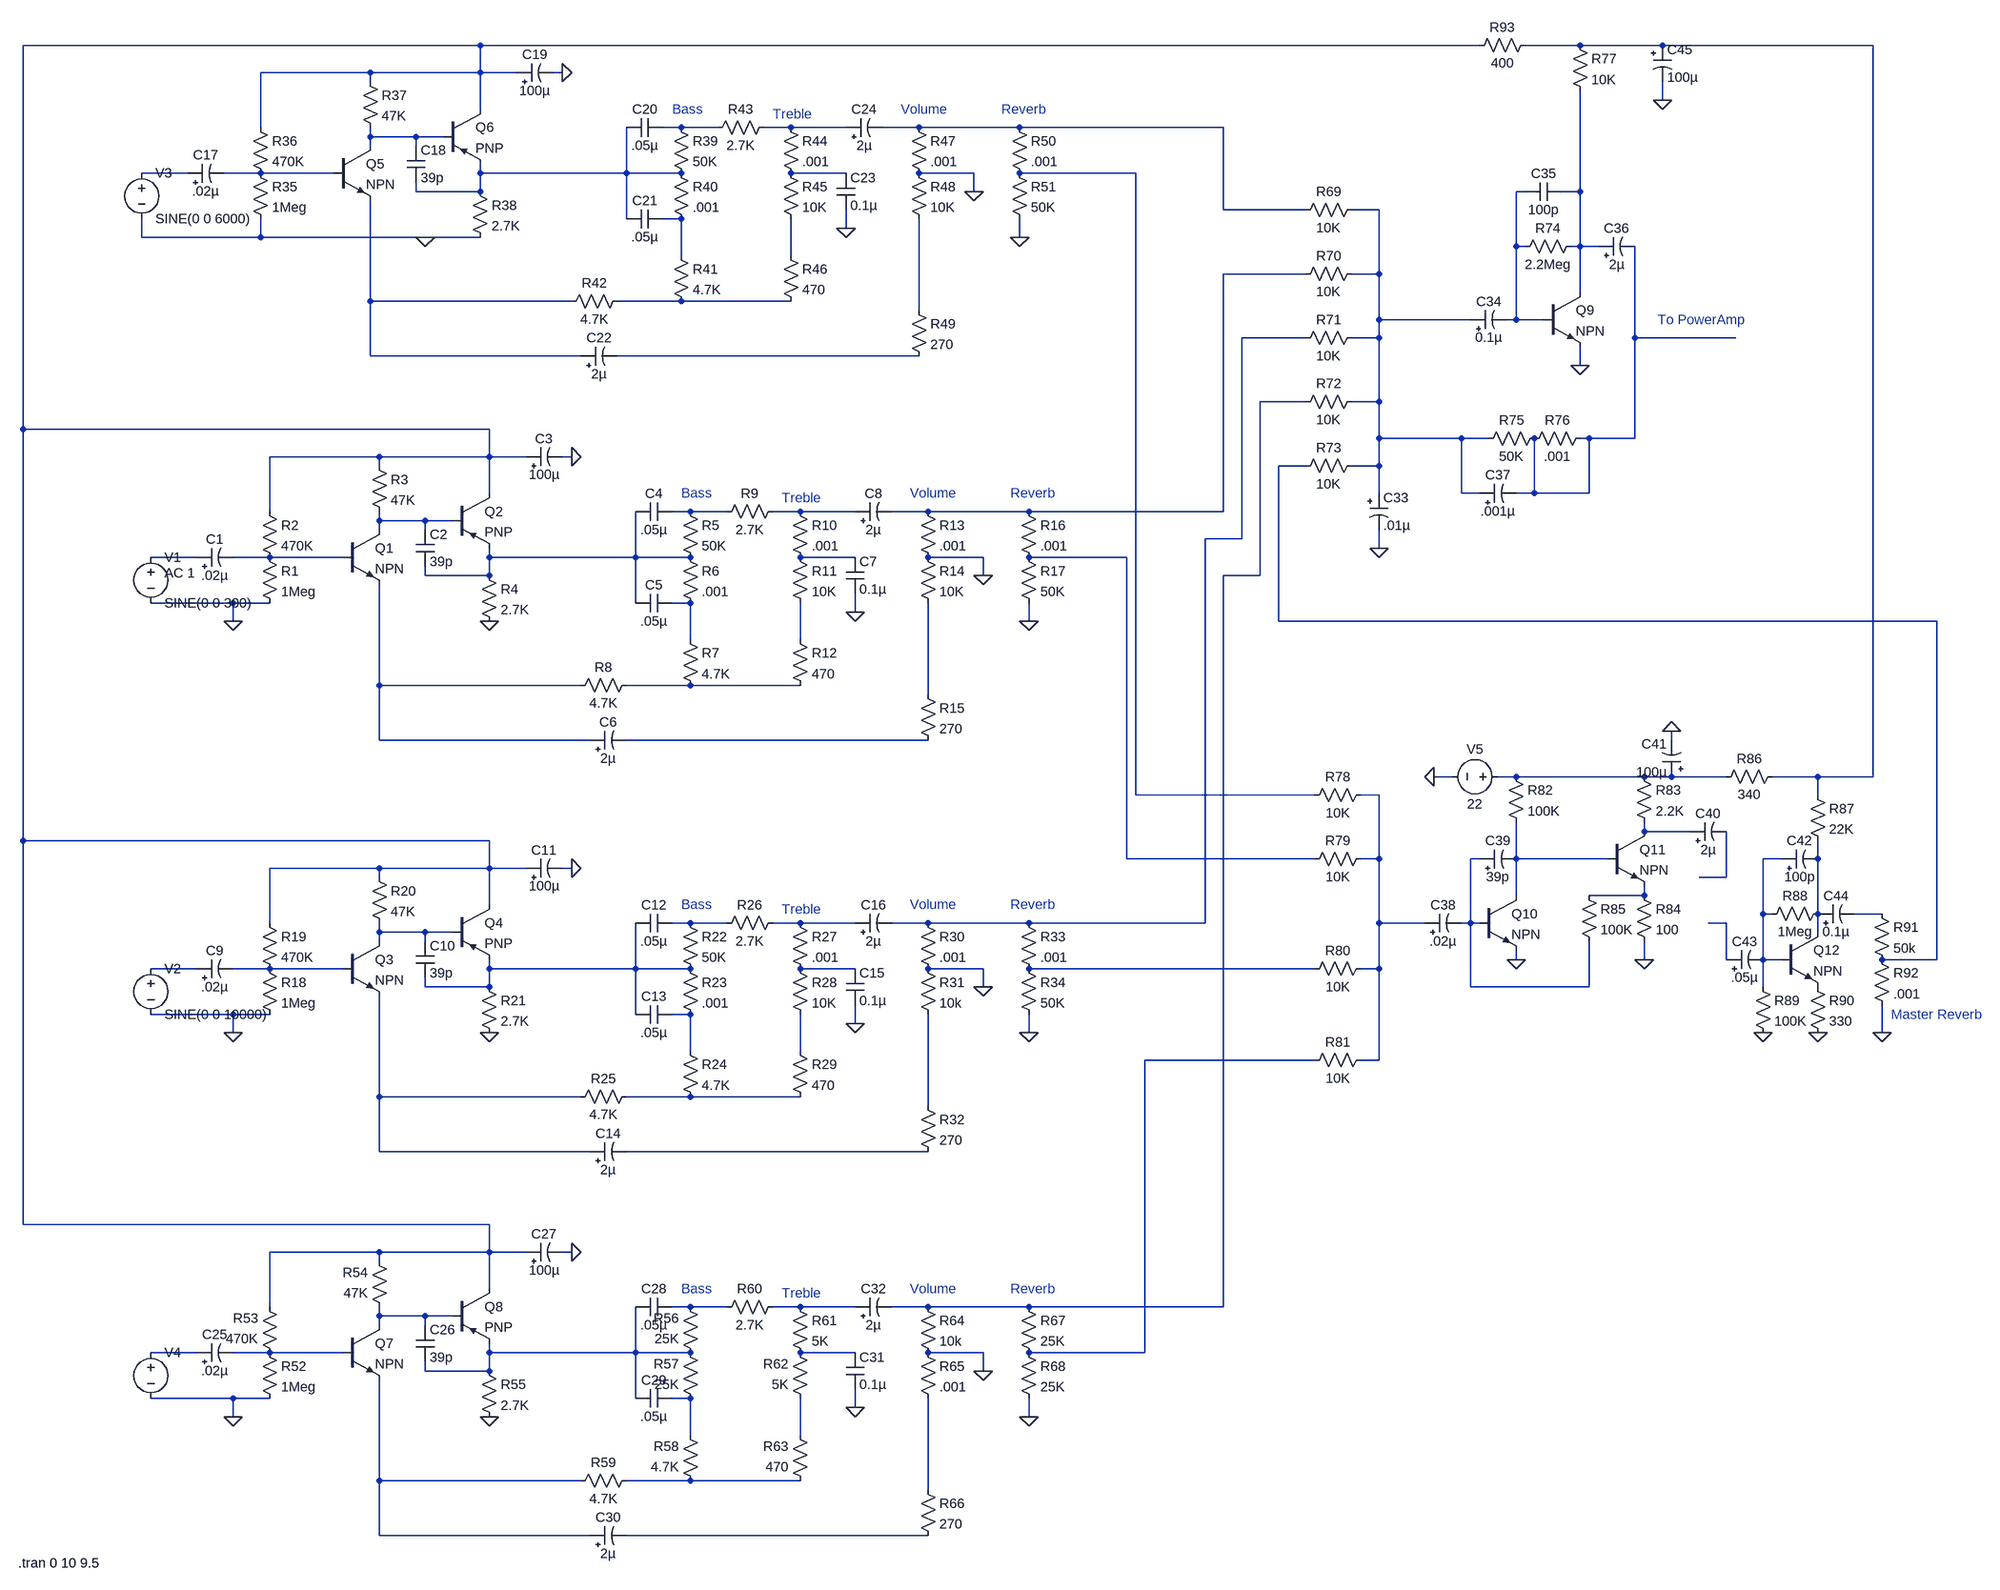
[diagram p0: schematic PA120.asc]
PA120.asc, the LTspice schematic file:
Version 4
SHEET 1 3108 1588
WIRE -64 -1088 -864 -1088
WIRE 2208 -1088 -64 -1088
WIRE 2384 -1088 2288 -1088
WIRE 2528 -1088 2384 -1088
WIRE 2896 -1088 2528 -1088
WIRE -256 -1040 -448 -1040
WIRE -64 -1040 -64 -1088
WIRE -64 -1040 -256 -1040
WIRE 0 -1040 -64 -1040
WIRE 80 -1040 64 -1040
WIRE -256 -1024 -256 -1040
WIRE 2528 -992 2528 -1024
WIRE -64 -976 -64 -1040
WIRE -448 -944 -448 -1040
WIRE 288 -944 256 -944
WIRE 352 -944 288 -944
WIRE 480 -944 432 -944
WIRE 576 -944 480 -944
WIRE 704 -944 640 -944
WIRE 880 -944 704 -944
WIRE 1760 -944 880 -944
WIRE -256 -928 -256 -944
WIRE -176 -928 -256 -928
WIRE -128 -928 -176 -928
WIRE -256 -912 -256 -928
WIRE -176 -912 -176 -928
WIRE -576 -864 -656 -864
WIRE -448 -864 -512 -864
WIRE -320 -864 -448 -864
WIRE -64 -864 -64 -880
WIRE 192 -864 192 -944
WIRE 192 -864 -64 -864
WIRE 288 -864 192 -864
WIRE 576 -864 480 -864
WIRE 800 -864 704 -864
WIRE 1168 -864 880 -864
WIRE -176 -832 -176 -848
WIRE -64 -832 -64 -864
WIRE -64 -832 -176 -832
WIRE 800 -832 800 -864
WIRE 2288 -832 2272 -832
WIRE 2384 -832 2384 -1008
WIRE 2384 -832 2352 -832
WIRE 1760 -800 1760 -944
WIRE 1904 -800 1760 -800
WIRE 2032 -800 1984 -800
WIRE 192 -784 192 -864
WIRE 288 -784 256 -784
WIRE 576 -768 576 -800
WIRE -656 -752 -656 -784
WIRE -448 -752 -448 -784
WIRE -448 -752 -656 -752
WIRE -160 -752 -448 -752
WIRE -64 -752 -160 -752
WIRE 880 -752 880 -784
WIRE 2272 -736 2272 -832
WIRE 2288 -736 2272 -736
WIRE 2384 -736 2384 -832
WIRE 2384 -736 2368 -736
WIRE 2416 -736 2384 -736
WIRE 288 -720 288 -784
WIRE 480 -720 480 -784
WIRE 1904 -688 1760 -688
WIRE 2032 -688 2032 -800
WIRE 2032 -688 1984 -688
WIRE 2384 -656 2384 -736
WIRE -256 -640 -256 -816
WIRE 96 -640 -256 -640
WIRE 288 -640 176 -640
WIRE 480 -640 288 -640
WIRE 704 -624 704 -784
WIRE 2032 -608 2032 -688
WIRE 2192 -608 2032 -608
WIRE 2272 -608 2272 -736
WIRE 2272 -608 2256 -608
WIRE 2320 -608 2272 -608
WIRE 1904 -576 1792 -576
WIRE 2032 -576 2032 -608
WIRE 2032 -576 1984 -576
WIRE 2480 -576 2480 -736
WIRE 2656 -576 2480 -576
WIRE -256 -544 -256 -640
WIRE 112 -544 -256 -544
WIRE 704 -544 176 -544
WIRE 2384 -528 2384 -560
WIRE 1904 -464 1824 -464
WIRE 2032 -464 2032 -576
WIRE 2032 -464 1984 -464
WIRE -864 -416 -864 -1088
WIRE -48 -416 -864 -416
WIRE 2032 -400 2032 -464
WIRE 2176 -400 2032 -400
WIRE 2224 -400 2176 -400
WIRE 2400 -400 2384 -400
WIRE 2480 -400 2480 -576
WIRE 2480 -400 2400 -400
WIRE -240 -368 -432 -368
WIRE -48 -368 -48 -416
WIRE -48 -368 -240 -368
WIRE 16 -368 -48 -368
WIRE 96 -368 80 -368
WIRE -240 -352 -240 -368
WIRE 1904 -352 1856 -352
WIRE 2032 -352 2032 -400
WIRE 2032 -352 1984 -352
WIRE -48 -304 -48 -368
WIRE 2032 -304 2032 -352
WIRE 2176 -304 2176 -400
WIRE 2208 -304 2176 -304
WIRE 2304 -304 2304 -400
WIRE 2304 -304 2272 -304
WIRE 2400 -304 2400 -400
WIRE 2400 -304 2304 -304
WIRE -432 -272 -432 -368
WIRE 304 -272 272 -272
WIRE 368 -272 304 -272
WIRE 496 -272 448 -272
WIRE 592 -272 496 -272
WIRE 720 -272 656 -272
WIRE 896 -272 720 -272
WIRE 1760 -272 1760 -688
WIRE 1760 -272 896 -272
WIRE -240 -256 -240 -272
WIRE -160 -256 -240 -256
WIRE -112 -256 -160 -256
WIRE -240 -240 -240 -256
WIRE -160 -240 -160 -256
WIRE 1792 -224 1792 -576
WIRE 1792 -224 1728 -224
WIRE 2032 -208 2032 -240
WIRE -560 -192 -640 -192
WIRE -432 -192 -496 -192
WIRE -304 -192 -432 -192
WIRE -48 -192 -48 -208
WIRE 208 -192 208 -272
WIRE 208 -192 -48 -192
WIRE 304 -192 208 -192
WIRE 592 -192 496 -192
WIRE 816 -192 720 -192
WIRE 1152 -192 896 -192
WIRE -160 -160 -160 -176
WIRE -48 -160 -48 -192
WIRE -48 -160 -160 -160
WIRE 816 -160 816 -192
WIRE 1824 -160 1824 -464
WIRE 1824 -160 1760 -160
WIRE -496 -112 -640 -112
WIRE -432 -112 -496 -112
WIRE 208 -112 208 -192
WIRE 304 -112 272 -112
WIRE 592 -96 592 -128
WIRE -496 -80 -496 -112
WIRE 896 -80 896 -112
WIRE 1856 -80 1856 -352
WIRE 3008 -80 1856 -80
WIRE 304 -48 304 -112
WIRE 496 -48 496 -112
WIRE -240 32 -240 -144
WIRE 112 32 -240 32
WIRE 304 32 192 32
WIRE 496 32 304 32
WIRE 720 48 720 -112
WIRE -240 128 -240 32
WIRE 128 128 -240 128
WIRE 720 128 192 128
WIRE 2544 128 2544 112
WIRE 2160 192 2128 192
WIRE 2272 192 2240 192
WIRE 2496 192 2272 192
WIRE 2544 192 2496 192
WIRE 2640 192 2544 192
WIRE 2800 192 2720 192
WIRE 2896 192 2896 -1088
WIRE 2896 192 2800 192
WIRE 1168 224 1168 -864
WIRE 1920 224 1168 224
WIRE 2032 224 2000 224
WIRE 2800 224 2800 192
WIRE 2496 288 2496 272
WIRE 2576 288 2496 288
WIRE -864 304 -864 -416
WIRE -48 304 -864 304
WIRE 1152 336 1152 -192
WIRE 1920 336 1152 336
WIRE 2032 336 2032 224
WIRE 2032 336 2000 336
WIRE 2208 336 2192 336
WIRE 2272 336 2272 272
WIRE 2432 336 2272 336
WIRE 2736 336 2704 336
WIRE 2800 336 2800 304
WIRE -240 352 -432 352
WIRE -48 352 -48 304
WIRE -48 352 -240 352
WIRE 16 352 -48 352
WIRE 96 352 80 352
WIRE -240 368 -240 352
WIRE 2640 368 2640 288
WIRE 2640 368 2592 368
WIRE 2272 400 2272 336
WIRE 2496 400 2496 384
WIRE 2496 400 2400 400
WIRE -48 416 -48 352
WIRE 2704 432 2704 336
WIRE 2720 432 2704 432
WIRE 2800 432 2800 336
WIRE 2912 432 2864 432
WIRE -432 448 -432 352
WIRE 304 448 272 448
WIRE 368 448 304 448
WIRE 496 448 448 448
WIRE 592 448 496 448
WIRE 720 448 656 448
WIRE 896 448 720 448
WIRE 1728 448 1728 -224
WIRE 1728 448 896 448
WIRE 2032 448 2032 336
WIRE 2112 448 2032 448
WIRE 2192 448 2192 336
WIRE 2192 448 2176 448
WIRE 2208 448 2192 448
WIRE 2640 448 2608 448
WIRE -240 464 -240 448
WIRE -160 464 -240 464
WIRE -112 464 -160 464
WIRE 2800 464 2800 432
WIRE -240 480 -240 464
WIRE -160 480 -160 464
WIRE 2272 512 2272 496
WIRE 2496 512 2496 480
WIRE 2640 512 2640 448
WIRE 2704 512 2704 432
WIRE 2736 512 2704 512
WIRE 3008 512 3008 -80
WIRE 3008 512 2912 512
WIRE -560 528 -640 528
WIRE -432 528 -496 528
WIRE -304 528 -432 528
WIRE -48 528 -48 512
WIRE 208 528 208 448
WIRE 208 528 -48 528
WIRE 304 528 208 528
WIRE 592 528 496 528
WIRE 816 528 720 528
WIRE 1920 528 896 528
WIRE 2032 528 2032 448
WIRE 2032 528 2000 528
WIRE -160 560 -160 544
WIRE -48 560 -48 528
WIRE -48 560 -160 560
WIRE 816 560 816 528
WIRE 2192 560 2192 448
WIRE 2400 560 2400 480
WIRE 2400 560 2192 560
WIRE 2704 560 2704 512
WIRE -496 608 -640 608
WIRE -432 608 -496 608
WIRE 208 608 208 528
WIRE 304 608 272 608
WIRE 592 624 592 592
WIRE -496 640 -496 608
WIRE 896 640 896 608
WIRE 2912 640 2912 592
WIRE 304 672 304 608
WIRE 496 672 496 608
WIRE 1920 688 1184 688
WIRE 2032 688 2032 528
WIRE 2032 688 2000 688
WIRE -240 752 -240 576
WIRE 112 752 -240 752
WIRE 304 752 192 752
WIRE 496 752 304 752
WIRE 720 768 720 608
WIRE -240 848 -240 752
WIRE 128 848 -240 848
WIRE 720 848 192 848
WIRE -864 976 -864 304
WIRE -48 976 -864 976
WIRE -240 1024 -432 1024
WIRE -48 1024 -48 976
WIRE -48 1024 -240 1024
WIRE 16 1024 -48 1024
WIRE 96 1024 80 1024
WIRE -240 1040 -240 1024
WIRE -48 1088 -48 1024
WIRE -432 1120 -432 1024
WIRE 304 1120 272 1120
WIRE 368 1120 304 1120
WIRE 496 1120 448 1120
WIRE 592 1120 496 1120
WIRE 720 1120 656 1120
WIRE 896 1120 720 1120
WIRE 1760 1120 1760 -160
WIRE 1760 1120 896 1120
WIRE -240 1136 -240 1120
WIRE -160 1136 -240 1136
WIRE -112 1136 -160 1136
WIRE -240 1152 -240 1136
WIRE -160 1152 -160 1136
WIRE -560 1200 -640 1200
WIRE -432 1200 -496 1200
WIRE -304 1200 -432 1200
WIRE -48 1200 -48 1184
WIRE 208 1200 208 1120
WIRE 208 1200 -48 1200
WIRE 304 1200 208 1200
WIRE 592 1200 496 1200
WIRE 816 1200 720 1200
WIRE 1184 1200 1184 688
WIRE 1184 1200 896 1200
WIRE -160 1232 -160 1216
WIRE -48 1232 -48 1200
WIRE -48 1232 -160 1232
WIRE 816 1232 816 1200
WIRE -496 1280 -640 1280
WIRE -432 1280 -496 1280
WIRE 208 1280 208 1200
WIRE 304 1280 272 1280
WIRE 592 1296 592 1264
WIRE -496 1312 -496 1280
WIRE 896 1312 896 1280
WIRE 304 1344 304 1280
WIRE 496 1344 496 1280
WIRE -240 1424 -240 1248
WIRE 112 1424 -240 1424
WIRE 304 1424 192 1424
WIRE 496 1424 304 1424
WIRE 720 1440 720 1280
WIRE -240 1520 -240 1424
WIRE 128 1520 -240 1520
WIRE 720 1520 192 1520
FLAG -496 -80 0
FLAG 96 -368 0
FLAG -48 -80 0
FLAG 592 -96 0
FLAG 816 -160 0
FLAG 896 -80 0
FLAG -496 640 0
FLAG 96 352 0
FLAG -48 640 0
FLAG 592 624 0
FLAG 816 560 0
FLAG 896 640 0
FLAG 80 -1040 0
FLAG 576 -768 0
FLAG 800 -832 0
FLAG 880 -752 0
FLAG -496 1312 0
FLAG 96 1024 0
FLAG -48 1312 0
FLAG 592 1296 0
FLAG 816 1232 0
FLAG 896 1312 0
FLAG 2032 -208 0
FLAG 2384 -528 0
FLAG 2272 512 0
FLAG 2496 512 0
FLAG 2544 112 0
FLAG 2704 640 0
FLAG 2800 640 0
FLAG 2912 640 0
FLAG 2128 192 0
FLAG 2528 -992 0
FLAG -160 -752 0
SYMBOL voltage -640 -208 R0
WINDOW 123 24 44 Left 0
WINDOW 39 0 0 Left 0
SYMATTR Value2 AC 1
SYMATTR InstName V1
SYMATTR Value SINE(0 0 300)
SYMBOL polcap -560 -176 R270
WINDOW 0 32 32 VTop 0
WINDOW 3 0 32 VBottom 0
SYMATTR InstName C1
SYMATTR Value .02µ
SYMATTR SpiceLine V=12
SYMBOL res -448 -208 R0
SYMATTR InstName R1
SYMATTR Value 1Meg
SYMBOL res -448 -288 R0
SYMATTR InstName R2
SYMATTR Value 470K
SYMBOL npn3 -304 -240 R0
SYMATTR InstName Q1
SYMBOL res -256 -368 R0
SYMATTR InstName R3
SYMATTR Value 47K
SYMBOL pnp2 -112 -304 R0
SYMATTR InstName Q2
SYMBOL cap -176 -240 R0
SYMATTR InstName C2
SYMATTR Value 39p
SYMBOL polcap 16 -352 R270
WINDOW 0 32 32 VTop 0
WINDOW 3 0 32 VBottom 0
SYMATTR InstName C3
SYMATTR Value 100µ
SYMBOL res -64 -176 R0
SYMATTR InstName R4
SYMATTR Value 2.7K
SYMBOL cap 272 -288 R90
WINDOW 0 0 32 VBottom 0
WINDOW 3 32 32 VTop 0
SYMATTR InstName C4
SYMATTR Value .05µ
SYMBOL cap 272 -128 R90
WINDOW 0 0 32 VBottom 0
WINDOW 3 32 32 VTop 0
SYMATTR InstName C5
SYMATTR Value .05µ
SYMBOL res 288 -288 R0
SYMATTR InstName R5
SYMATTR Value 50K
SYMBOL res 288 -208 R0
SYMATTR InstName R6
SYMATTR Value .001
SYMBOL res 288 -64 R0
SYMATTR InstName R7
SYMATTR Value 4.7K
SYMBOL res 208 16 R90
WINDOW 0 0 56 VBottom 0
WINDOW 3 32 56 VTop 0
SYMATTR InstName R8
SYMATTR Value 4.7K
SYMBOL polcap 128 144 R270
WINDOW 0 32 32 VTop 0
WINDOW 3 0 32 VBottom 0
SYMATTR InstName C6
SYMATTR Value 2µ
SYMBOL res 352 -256 R270
WINDOW 0 32 56 VTop 0
WINDOW 3 0 56 VBottom 0
SYMATTR InstName R9
SYMATTR Value 2.7K
SYMBOL res 480 -288 R0
SYMATTR InstName R10
SYMATTR Value .001
SYMBOL res 480 -208 R0
SYMATTR InstName R11
SYMATTR Value 10K
SYMBOL res 480 -64 R0
SYMATTR InstName R12
SYMATTR Value 470
SYMBOL cap 576 -192 R0
SYMATTR InstName C7
SYMATTR Value 0.1µ
SYMBOL polcap 592 -256 R270
WINDOW 0 32 32 VTop 0
WINDOW 3 0 32 VBottom 0
SYMATTR InstName C8
SYMATTR Value 2µ
SYMBOL res 704 -288 R0
SYMATTR InstName R13
SYMATTR Value .001
SYMBOL res 704 -208 R0
SYMATTR InstName R14
SYMATTR Value 10K
SYMBOL res 704 32 R0
SYMATTR InstName R15
SYMATTR Value 270
SYMBOL res 880 -288 R0
SYMATTR InstName R16
SYMATTR Value .001
SYMBOL res 880 -208 R0
SYMATTR InstName R17
SYMATTR Value 50K
SYMBOL voltage -640 512 R0
WINDOW 123 0 0 Left 0
WINDOW 39 0 0 Left 0
SYMATTR InstName V2
SYMATTR Value SINE(0 0 10000)
SYMBOL polcap -560 544 R270
WINDOW 0 32 32 VTop 0
WINDOW 3 0 32 VBottom 0
SYMATTR InstName C9
SYMATTR Value .02µ
SYMATTR SpiceLine V=12
SYMBOL res -448 512 R0
SYMATTR InstName R18
SYMATTR Value 1Meg
SYMBOL res -448 432 R0
SYMATTR InstName R19
SYMATTR Value 470K
SYMBOL npn3 -304 480 R0
SYMATTR InstName Q3
SYMBOL res -256 352 R0
SYMATTR InstName R20
SYMATTR Value 47K
SYMBOL pnp2 -112 416 R0
SYMATTR InstName Q4
SYMBOL cap -176 480 R0
SYMATTR InstName C10
SYMATTR Value 39p
SYMBOL polcap 16 368 R270
WINDOW 0 32 32 VTop 0
WINDOW 3 0 32 VBottom 0
SYMATTR InstName C11
SYMATTR Value 100µ
SYMBOL res -64 544 R0
SYMATTR InstName R21
SYMATTR Value 2.7K
SYMBOL cap 272 432 R90
WINDOW 0 0 32 VBottom 0
WINDOW 3 32 32 VTop 0
SYMATTR InstName C12
SYMATTR Value .05µ
SYMBOL cap 272 592 R90
WINDOW 0 0 32 VBottom 0
WINDOW 3 32 32 VTop 0
SYMATTR InstName C13
SYMATTR Value .05µ
SYMBOL res 288 432 R0
SYMATTR InstName R22
SYMATTR Value 50K
SYMBOL res 288 512 R0
SYMATTR InstName R23
SYMATTR Value .001
SYMBOL res 288 656 R0
SYMATTR InstName R24
SYMATTR Value 4.7K
SYMBOL res 208 736 R90
WINDOW 0 0 56 VBottom 0
WINDOW 3 32 56 VTop 0
SYMATTR InstName R25
SYMATTR Value 4.7K
SYMBOL polcap 128 864 R270
WINDOW 0 32 32 VTop 0
WINDOW 3 0 32 VBottom 0
SYMATTR InstName C14
SYMATTR Value 2µ
SYMBOL res 352 464 R270
WINDOW 0 32 56 VTop 0
WINDOW 3 0 56 VBottom 0
SYMATTR InstName R26
SYMATTR Value 2.7K
SYMBOL res 480 432 R0
SYMATTR InstName R27
SYMATTR Value .001
SYMBOL res 480 512 R0
SYMATTR InstName R28
SYMATTR Value 10K
SYMBOL res 480 656 R0
SYMATTR InstName R29
SYMATTR Value 470
SYMBOL cap 576 528 R0
SYMATTR InstName C15
SYMATTR Value 0.1µ
SYMBOL polcap 592 464 R270
WINDOW 0 32 32 VTop 0
WINDOW 3 0 32 VBottom 0
SYMATTR InstName C16
SYMATTR Value 2µ
SYMBOL res 704 432 R0
SYMATTR InstName R30
SYMATTR Value .001
SYMBOL res 704 512 R0
SYMATTR InstName R31
SYMATTR Value 10k
SYMBOL res 704 752 R0
SYMATTR InstName R32
SYMATTR Value 270
SYMBOL res 880 432 R0
SYMATTR InstName R33
SYMATTR Value .001
SYMBOL res 880 512 R0
SYMATTR InstName R34
SYMATTR Value 50K
SYMBOL voltage -656 -880 R0
WINDOW 123 0 0 Left 0
WINDOW 39 0 0 Left 0
SYMATTR InstName V3
SYMATTR Value SINE(0 0 6000)
SYMBOL polcap -576 -848 R270
WINDOW 0 32 32 VTop 0
WINDOW 3 0 32 VBottom 0
SYMATTR InstName C17
SYMATTR Value .02µ
SYMATTR SpiceLine V=12
SYMBOL res -464 -880 R0
SYMATTR InstName R35
SYMATTR Value 1Meg
SYMBOL res -464 -960 R0
SYMATTR InstName R36
SYMATTR Value 470K
SYMBOL npn3 -320 -912 R0
SYMATTR InstName Q5
SYMBOL res -272 -1040 R0
SYMATTR InstName R37
SYMATTR Value 47K
SYMBOL pnp2 -128 -976 R0
SYMATTR InstName Q6
SYMBOL cap -192 -912 R0
SYMATTR InstName C18
SYMATTR Value 39p
SYMBOL polcap 0 -1024 R270
WINDOW 0 32 32 VTop 0
WINDOW 3 0 32 VBottom 0
SYMATTR InstName C19
SYMATTR Value 100µ
SYMBOL res -80 -848 R0
SYMATTR InstName R38
SYMATTR Value 2.7K
SYMBOL cap 256 -960 R90
WINDOW 0 0 32 VBottom 0
WINDOW 3 32 32 VTop 0
SYMATTR InstName C20
SYMATTR Value .05µ
SYMBOL cap 256 -800 R90
WINDOW 0 0 32 VBottom 0
WINDOW 3 32 32 VTop 0
SYMATTR InstName C21
SYMATTR Value .05µ
SYMBOL res 272 -960 R0
SYMATTR InstName R39
SYMATTR Value 50K
SYMBOL res 272 -880 R0
SYMATTR InstName R40
SYMATTR Value .001
SYMBOL res 272 -736 R0
SYMATTR InstName R41
SYMATTR Value 4.7K
SYMBOL res 192 -656 R90
WINDOW 0 0 56 VBottom 0
WINDOW 3 32 56 VTop 0
SYMATTR InstName R42
SYMATTR Value 4.7K
SYMBOL polcap 112 -528 R270
WINDOW 0 32 32 VTop 0
WINDOW 3 0 32 VBottom 0
SYMATTR InstName C22
SYMATTR Value 2µ
SYMBOL res 336 -928 R270
WINDOW 0 32 56 VTop 0
WINDOW 3 0 56 VBottom 0
SYMATTR InstName R43
SYMATTR Value 2.7K
SYMBOL res 464 -960 R0
SYMATTR InstName R44
SYMATTR Value .001
SYMBOL res 464 -880 R0
SYMATTR InstName R45
SYMATTR Value 10K
SYMBOL res 464 -736 R0
SYMATTR InstName R46
SYMATTR Value 470
SYMBOL cap 560 -864 R0
SYMATTR InstName C23
SYMATTR Value 0.1µ
SYMBOL polcap 576 -928 R270
WINDOW 0 32 32 VTop 0
WINDOW 3 0 32 VBottom 0
SYMATTR InstName C24
SYMATTR Value 2µ
SYMBOL res 688 -960 R0
SYMATTR InstName R47
SYMATTR Value .001
SYMBOL res 688 -880 R0
SYMATTR InstName R48
SYMATTR Value 10K
SYMBOL res 688 -640 R0
SYMATTR InstName R49
SYMATTR Value 270
SYMBOL res 864 -960 R0
SYMATTR InstName R50
SYMATTR Value .001
SYMBOL res 864 -880 R0
SYMATTR InstName R51
SYMATTR Value 50K
SYMBOL voltage -640 1184 R0
WINDOW 39 0 0 Left 0
WINDOW 3 24 104 Invisible 0
SYMATTR Value SINE(0 1 4000)
SYMATTR Value2 AC 1
SYMATTR InstName V4
SYMBOL polcap -560 1216 R270
WINDOW 0 32 32 VTop 0
WINDOW 3 0 32 VBottom 0
SYMATTR InstName C25
SYMATTR Value .02µ
SYMATTR SpiceLine V=12
SYMBOL res -448 1184 R0
SYMATTR InstName R52
SYMATTR Value 1Meg
SYMBOL res -416 1216 R180
WINDOW 0 36 76 Left 0
WINDOW 3 36 40 Left 0
SYMATTR InstName R53
SYMATTR Value 470K
SYMBOL npn3 -304 1152 R0
SYMATTR InstName Q7
SYMBOL res -224 1136 R180
WINDOW 0 36 76 Left 0
WINDOW 3 36 40 Left 0
SYMATTR InstName R54
SYMATTR Value 47K
SYMBOL pnp2 -112 1088 R0
SYMATTR InstName Q8
SYMBOL cap -176 1152 R0
SYMATTR InstName C26
SYMATTR Value 39p
SYMBOL polcap 16 1040 R270
WINDOW 0 32 32 VTop 0
WINDOW 3 0 32 VBottom 0
SYMATTR InstName C27
SYMATTR Value 100µ
SYMBOL res -64 1216 R0
SYMATTR InstName R55
SYMATTR Value 2.7K
SYMBOL cap 208 1136 R270
WINDOW 0 32 32 VTop 0
WINDOW 3 0 32 VBottom 0
SYMATTR InstName C28
SYMATTR Value .05µ
SYMBOL cap 272 1264 R90
WINDOW 0 0 32 VBottom 0
WINDOW 3 32 32 VTop 0
SYMATTR InstName C29
SYMATTR Value .05µ
SYMBOL res 320 1216 R180
WINDOW 0 36 76 Left 0
WINDOW 3 36 40 Left 0
SYMATTR InstName R56
SYMATTR Value 25K
SYMBOL res 320 1296 R180
WINDOW 0 36 76 Left 0
WINDOW 3 36 40 Left 0
SYMATTR InstName R57
SYMATTR Value 25K
SYMBOL res 320 1440 R180
WINDOW 0 36 76 Left 0
WINDOW 3 36 40 Left 0
SYMATTR InstName R58
SYMATTR Value 4.7K
SYMBOL res 96 1440 R270
WINDOW 0 32 56 VTop 0
WINDOW 3 0 56 VBottom 0
SYMATTR InstName R59
SYMATTR Value 4.7K
SYMBOL polcap 128 1536 R270
WINDOW 0 32 32 VTop 0
WINDOW 3 0 32 VBottom 0
SYMATTR InstName C30
SYMATTR Value 2µ
SYMBOL res 352 1136 R270
WINDOW 0 32 56 VTop 0
WINDOW 3 0 56 VBottom 0
SYMATTR InstName R60
SYMATTR Value 2.7K
SYMBOL res 480 1104 R0
SYMATTR InstName R61
SYMATTR Value 5K
SYMBOL res 512 1296 R180
WINDOW 0 36 76 Left 0
WINDOW 3 36 40 Left 0
SYMATTR InstName R62
SYMATTR Value 5K
SYMBOL res 512 1440 R180
WINDOW 0 36 76 Left 0
WINDOW 3 36 40 Left 0
SYMATTR InstName R63
SYMATTR Value 470
SYMBOL cap 576 1200 R0
SYMATTR InstName C31
SYMATTR Value 0.1µ
SYMBOL polcap 592 1136 R270
WINDOW 0 32 32 VTop 0
WINDOW 3 0 32 VBottom 0
SYMATTR InstName C32
SYMATTR Value 2µ
SYMBOL res 704 1104 R0
SYMATTR InstName R64
SYMATTR Value 10k
SYMBOL res 704 1184 R0
SYMATTR InstName R65
SYMATTR Value .001
SYMBOL res 704 1424 R0
SYMATTR InstName R66
SYMATTR Value 270
SYMBOL res 880 1104 R0
SYMATTR InstName R67
SYMATTR Value 25K
SYMBOL res 880 1184 R0
SYMATTR InstName R68
SYMATTR Value 25K
SYMBOL res 2000 -816 R90
WINDOW 0 0 56 VBottom 0
WINDOW 3 32 56 VTop 0
SYMATTR InstName R69
SYMATTR Value 10K
SYMBOL res 2000 -704 R90
WINDOW 0 0 56 VBottom 0
WINDOW 3 32 56 VTop 0
SYMATTR InstName R70
SYMATTR Value 10K
SYMBOL res 2000 -592 R90
WINDOW 0 0 56 VBottom 0
WINDOW 3 32 56 VTop 0
SYMATTR InstName R71
SYMATTR Value 10K
SYMBOL res 2000 -480 R90
WINDOW 0 0 56 VBottom 0
WINDOW 3 32 56 VTop 0
SYMATTR InstName R72
SYMATTR Value 10K
SYMBOL res 2000 -368 R90
WINDOW 0 0 56 VBottom 0
WINDOW 3 32 56 VTop 0
SYMATTR InstName R73
SYMATTR Value 10K
SYMBOL polcap 2016 -304 R0
SYMATTR InstName C33
SYMATTR Value .01µ
SYMBOL polcap 2192 -592 R270
WINDOW 0 32 32 VTop 0
WINDOW 3 0 32 VBottom 0
SYMATTR InstName C34
SYMATTR Value 0.1µ
SYMBOL npn3 2320 -656 R0
SYMATTR InstName Q9
SYMBOL res 2384 -752 R90
WINDOW 0 0 56 VBottom 0
WINDOW 3 32 56 VTop 0
SYMATTR InstName R74
SYMATTR Value 2.2Meg
SYMBOL cap 2352 -848 R90
WINDOW 0 0 32 VBottom 0
WINDOW 3 32 32 VTop 0
SYMATTR InstName C35
SYMATTR Value 100p
SYMBOL polcap 2416 -720 R270
WINDOW 0 32 32 VTop 0
WINDOW 3 0 32 VBottom 0
SYMATTR InstName C36
SYMATTR Value 2µ
SYMBOL res 2320 -416 R90
WINDOW 0 0 56 VBottom 0
WINDOW 3 32 56 VTop 0
SYMATTR InstName R75
SYMATTR Value 50K
SYMBOL res 2400 -416 R90
WINDOW 0 0 56 VBottom 0
WINDOW 3 32 56 VTop 0
SYMATTR InstName R76
SYMATTR Value .001
SYMBOL polcap 2208 -288 R270
WINDOW 0 32 32 VTop 0
WINDOW 3 0 32 VBottom 0
SYMATTR InstName C37
SYMATTR Value .001µ
SYMBOL res 2368 -1104 R0
SYMATTR InstName R77
SYMATTR Value 10K
SYMBOL res 2016 208 R90
WINDOW 0 0 56 VBottom 0
WINDOW 3 32 56 VTop 0
SYMATTR InstName R78
SYMATTR Value 10K
SYMBOL res 2016 320 R90
WINDOW 0 0 56 VBottom 0
WINDOW 3 32 56 VTop 0
SYMATTR InstName R79
SYMATTR Value 10K
SYMBOL res 2016 512 R90
WINDOW 0 0 56 VBottom 0
WINDOW 3 32 56 VTop 0
SYMATTR InstName R80
SYMATTR Value 10K
SYMBOL res 2016 672 R90
WINDOW 0 0 56 VBottom 0
WINDOW 3 32 56 VTop 0
SYMATTR InstName R81
SYMATTR Value 10K
SYMBOL polcap 2112 464 R270
WINDOW 0 32 32 VTop 0
WINDOW 3 0 32 VBottom 0
SYMATTR InstName C38
SYMATTR Value .02µ
SYMBOL npn3 2208 400 R0
SYMATTR InstName Q10
SYMBOL npn3 2432 288 R0
SYMATTR InstName Q11
SYMBOL npn3 2736 464 R0
SYMATTR InstName Q12
SYMBOL polcap 2208 352 R270
WINDOW 0 32 32 VTop 0
WINDOW 3 0 32 VBottom 0
SYMATTR InstName C39
SYMATTR Value 39p
SYMBOL res 2256 176 R0
SYMATTR InstName R82
SYMATTR Value 100K
SYMBOL res 2480 176 R0
SYMATTR InstName R83
SYMATTR Value 2.2K
SYMBOL polcap 2576 304 R270
WINDOW 0 32 32 VTop 0
WINDOW 3 0 32 VBottom 0
SYMATTR InstName C40
SYMATTR Value 2µ
SYMBOL res 2480 384 R0
SYMATTR InstName R84
SYMATTR Value 100
SYMBOL res 2384 384 R0
SYMATTR InstName R85
SYMATTR Value 100K
SYMBOL polcap 2560 192 R180
WINDOW 0 24 57 Left 0
WINDOW 3 24 8 Left 0
SYMATTR InstName C41
SYMATTR Value 100µ
SYMBOL res 2736 176 R90
WINDOW 0 0 56 VBottom 0
WINDOW 3 32 56 VTop 0
SYMATTR InstName R86
SYMATTR Value 340
SYMBOL res 2784 208 R0
SYMATTR InstName R87
SYMATTR Value 22K
SYMBOL res 2816 416 R90
WINDOW 0 0 56 VBottom 0
WINDOW 3 32 56 VTop 0
SYMATTR InstName R88
SYMATTR Value 1Meg
SYMBOL res 2688 544 R0
SYMATTR InstName R89
SYMATTR Value 100K
SYMBOL polcap 2640 528 R270
WINDOW 0 32 32 VTop 0
WINDOW 3 0 32 VBottom 0
SYMATTR InstName C43
SYMATTR Value .05µ
SYMBOL res 2784 544 R0
SYMATTR InstName R90
SYMATTR Value 330
SYMBOL polcap 2800 448 R270
WINDOW 0 32 32 VTop 0
WINDOW 3 0 32 VBottom 0
SYMATTR InstName C44
SYMATTR Value 0.1µ
SYMBOL polcap 2736 352 R270
WINDOW 0 32 32 VTop 0
WINDOW 3 0 32 VBottom 0
SYMATTR InstName C42
SYMATTR Value 100p
SYMBOL res 2896 416 R0
SYMATTR InstName R91
SYMATTR Value 50k
SYMBOL res 2896 496 R0
SYMATTR InstName R92
SYMATTR Value .001
SYMBOL voltage 2256 192 R90
WINDOW 0 -32 56 VBottom 0
WINDOW 3 32 56 VTop 0
WINDOW 123 0 0 Left 0
WINDOW 39 0 0 Left 0
SYMATTR InstName V5
SYMATTR Value 22
SYMBOL polcap 2512 -1088 R0
SYMATTR InstName C45
SYMATTR Value 100µ
SYMBOL res 2304 -1104 R90
WINDOW 0 0 56 VBottom 0
WINDOW 3 32 56 VTop 0
SYMATTR InstName R93
SYMATTR Value 400
TEXT 288 -304 Left 0 ;Bass
TEXT 464 -296 Left 0 ;Treble
TEXT 688 -304 Left 0 ;Volume
TEXT 864 -304 Left 0 ;Reverb
TEXT 288 416 Left 0 ;Bass
TEXT 464 424 Left 0 ;Treble
TEXT 688 416 Left 0 ;Volume
TEXT 864 416 Left 0 ;Reverb
TEXT 272 -976 Left 0 ;Bass
TEXT 448 -968 Left 0 ;Treble
TEXT 672 -976 Left 0 ;Volume
TEXT 848 -976 Left 0 ;Reverb
TEXT 288 1088 Left 0 ;Bass
TEXT 464 1096 Left 0 ;Treble
TEXT 688 1088 Left 0 ;Volume
TEXT 864 1088 Left 0 ;Reverb
TEXT 2520 -608 Left 0 ;To PowerAmp
TEXT 2928 608 Left 0 ;Master Reverb
TEXT -872 1568 Left 0 !.tran 0 10 9.5

The netlist it stands for:
* PA120.asc
V1 N029 0 SINE(0 0 300) AC 1
C1 N029 N030 .02µ V=12
R1 N030 0 1Meg
R2 N001 N030 470K
Q1 N028 N030 N036 0 NPN
R3 N001 N028 47K
Q2 N001 N028 N031 0 PNP
C2 N028 N031 39p
C3 N001 0 100µ
R4 N031 0 2.7K
C4 N026 N031 .05µ
C5 N034 N031 .05µ
R5 N026 N031 50K
R6 N031 N034 .001
R7 N034 N037 4.7K
R8 N037 N036 4.7K
C6 N036 N039 2µ
R9 N026 N027 2.7K
R10 N027 N032 .001
R11 N032 N035 10K
R12 N035 N037 470
C7 N032 0 0.1µ
C8 N027 N017 2µ
R13 N017 0 .001
R14 0 N038 10K
R15 N038 N039 270
R16 N017 N033 .001
R17 N033 0 50K
V2 N054 0 SINE(0 0 10000)
C9 N054 N055 .02µ V=12
R18 N055 0 1Meg
R19 N001 N055 470K
Q3 N053 N055 N062 0 NPN
R20 N001 N053 47K
Q4 N001 N053 N056 0 PNP
C10 N053 N056 39p
C11 N001 0 100µ
R21 N056 0 2.7K
C12 N050 N056 .05µ
C13 N059 N056 .05µ
R22 N050 N056 50K
R23 N056 N059 .001
R24 N059 N063 4.7K
R25 N063 N062 4.7K
C14 N062 N065 2µ
R26 N050 N051 2.7K
R27 N051 N057 .001
R28 N057 N060 10K
R29 N060 N063 470
C15 N057 0 0.1µ
C16 N051 N021 2µ
R30 N021 0 .001
R31 0 N064 10k
R32 N064 N065 270
R33 N021 N058 .001
R34 N058 0 50K
V3 N007 0 SINE(0 0 6000)
C17 N007 N008 .02µ V=12
R35 N008 0 1Meg
R36 N001 N008 470K
Q5 N006 N008 N018 0 NPN
R37 N001 N006 47K
Q6 N001 N006 N009 0 PNP
C18 N006 N009 39p
C19 N001 0 100µ
R38 N009 0 2.7K
C20 N003 N009 .05µ
C21 N015 N009 .05µ
R39 N003 N009 50K
R40 N009 N015 .001
R41 N015 N019 4.7K
R42 N019 N018 4.7K
C22 N018 N023 2µ
R43 N003 N004 2.7K
R44 N004 N010 .001
R45 N010 N016 10K
R46 N016 N019 470
C23 N010 0 0.1µ
C24 N004 N005 2µ
R47 N005 0 .001
R48 0 N020 10K
R49 N020 N023 270
R50 N005 N011 .001
R51 N011 0 50K
V4 N069 0 SINE(0 1 4000) AC 1
C25 N069 N070 .02µ V=12
R52 N070 0 1Meg
R53 N070 N001 470K
Q7 N068 N070 N075 0 NPN
R54 N068 N001 47K
Q8 N001 N068 N071 0 PNP
C26 N068 N071 39p
C27 N001 0 100µ
R55 N071 0 2.7K
C28 N071 N066 .05µ
C29 N073 N071 .05µ
R56 N071 N066 25K
R57 N073 N071 25K
R58 N076 N073 4.7K
R59 N075 N076 4.7K
C30 N075 N078 2µ
R60 N066 N067 2.7K
R61 N067 N072 5K
R62 N074 N072 5K
R63 N076 N074 470
C31 N072 0 0.1µ
C32 N067 N024 2µ
R64 N024 0 10k
R65 0 N077 .001
R66 N077 N078 270
R67 N024 N061 25K
R68 N061 0 25K
R69 N014 N005 10K
R70 N014 N017 10K
R71 N014 N021 10K
R72 N014 N024 10K
R73 N014 N025 10K
C33 N014 0 .01µ
C34 N014 N012 0.1µ
Q9 N013 N012 0 0 NPN
R74 N013 N012 2.2Meg
C35 N013 N012 100p
C36 N013 N022 2µ
R75 N022 N014 50K
R76 N022 N022 .001
C37 N014 N022 .001µ
R77 N002 N013 10K
R78 N041 N011 10K
R79 N041 N033 10K
R80 N041 N058 10K
R81 N041 N061 10K
C38 N041 N043 .02µ
Q10 N044 N043 0 0 NPN
Q11 N042 N044 N048 0 NPN
Q12 N046 N045 P001 0 NPN
C39 N043 N044 39p
R82 N040 N044 100K
R83 N040 N042 2.2K
C40 N042 N047 2µ
R84 N048 0 100
R85 N048 N043 100K
C41 N040 0 100µ
R86 N002 N040 340
R87 N002 N046 22K
R88 N046 N045 1Meg
R89 N045 0 100K
C43 N052 N045 .05µ
R90 P001 0 330
C44 N046 N049 0.1µ
C42 N045 N046 100p
R91 N049 N025 50k
R92 N025 0 .001
V5 N040 0 22
C45 N002 0 100µ
R93 N002 N001 400
.model NPN NPN
.model PNP PNP
.lib standard.bjt
* Bass
* Treble
* Volume
* Reverb
* Bass
* Treble
* Volume
* Reverb
* Bass
* Treble
* Volume
* Reverb
* Bass
* Treble
* Volume
* Reverb
* To PowerAmp
* Master Reverb
.tran 0 10 9.5
.backanno
.end